# EAGLE design pump-board (EAGLE 7.3.0)
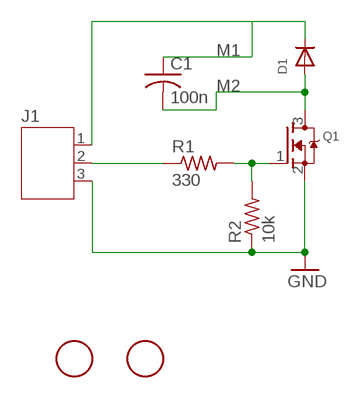
[diagram p0: schematic, sheet 1]

## Parts
C1  100n  C-USC1206  [C1206]
D1  DIODESOD-123  [SOD-123]
J1  JST-PH3  [JST-PH3]
Q1  MOSFET-NREFLOW  [SOT23]
R1  330  R-US_R1206  [R1206]
R2  10k  R-US_R1206  [R1206]
U$1  FIDUCIAL  [FIDUCIAL_1MM]
U$2  FIDUCIAL  [FIDUCIAL_1MM]

## Nets
GATE: Q1.1(G) R1.2 R2.2
GND: J1.3 Q1.2(S) R2.1
M1: C1.1 D1.C J1.1
M2: C1.2 D1.A Q1.3(D)
N$3: J1.2 R1.1

## Library data of the parts
C1 = adafruit:C-US: CAPACITOR, American symbol
D1 = adafruit:DIODE: Diode SMADIODE - SMA Surface Mount Package 20V 1A Schottky Diode Digikey: 641-1014-6-ND DO-1N4148 - Through Hole Small Current Diode SOD-123 20V 1 A (.5mV Vf) Schottky Diode - Digikey: MBRX120TPMSCT-ND SOD-323 10V 570mA (.38mV Vf, 3ns) Schottky Diode - Digikey: ZLLS410CT-ND SOD-523 30V 30mA Schottky Diode (RB751S-40TE61) - Digikey: RB751S-40TE61CT-ND SOT23-R/W - SOT23 Package (R = Solder Paste/Reflow Ovens, W = Hand-Soldering) BAT54Film 40V 300mA - Digikey: 497-7162-1-ND
J1 = jst-ph:JST-PH3
Q1 = adafruit:MOSFET-N: N-Channel Mosfet 2N7002E - 60V 260mA SOT23 [Digikey: 2N7002ET1GOSTR-ND] - REEL BSH103 - 30V 850mA SOT23 [Digikey: 568-5013-1-ND]
R1 R2 = adafruit:R-US_: RESISTOR, American symbol
U$1 U$2 = adafruit:FIDUCIAL: For use by pick and place machines to calibrate the vision/machine, 1mm By microbuilder.eu

## Board
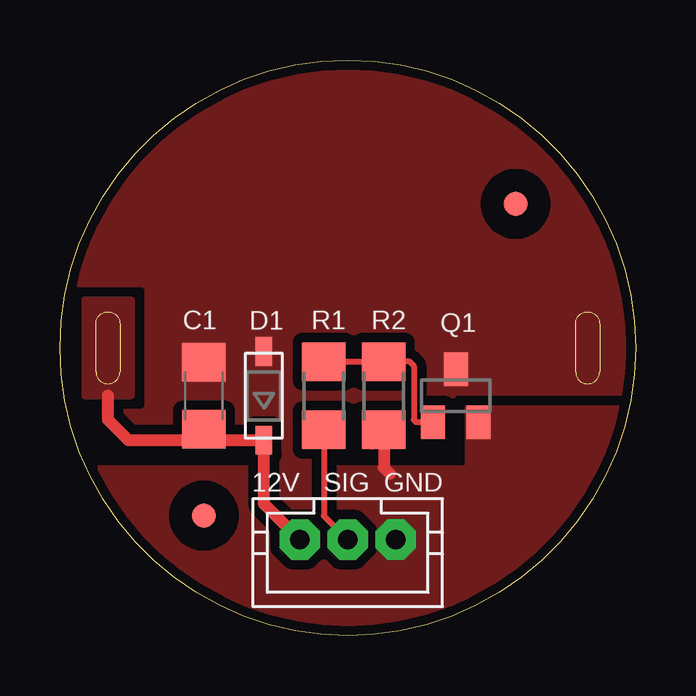
[diagram p1: board, top side]
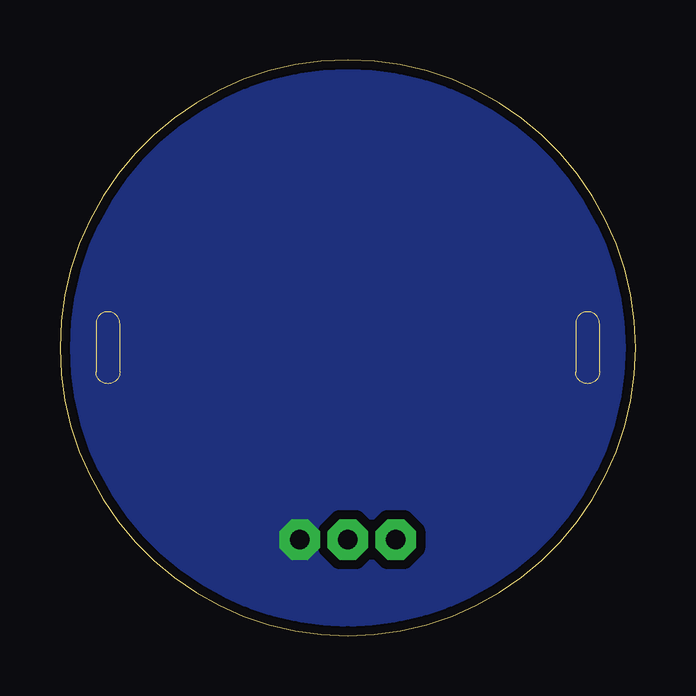
[diagram p2: board, bottom side, seen from below]

Size 24 x 24 mm. Coordinates in mm from the lower left corner, seen from the top.
Outline: 0,12 arc-90 12,24 arc-90 24,12 arc-90 12,0 arc-90 0,12
Copper layers (1*16): Top 0.035mm / dielectric 1.5mm / Bottom 0.035mm
Design rules "default": minimum track width 6mil, minimum drill 0.3mm, track to track 6mil, track to pad 6mil, pad to pad 6mil, via to via 6mil, smd to smd 0mil, copper to edge 0.25mm, drill to drill 0.25mm, minimum pad ring 10mil, minimum via ring 6mil, stop-mask expansion 2mil, vias tented up to drill 100mil, thermal gap 10mil
Milling: 12 lines

### Footprints (pad centres in the part's own frame; a part is rotated, then mirrored left to right if it is on the bottom)
C1206 = smd 1.6 x 1.8: 1 -1.4,0; 2 1.4,0
SOD-123 = smd 1.2 x 0.7: A 1.85,0; C -1.85,0
JST-PH3 = drill 0.813 pad 1.676 octagon: 1 2,0; 2 0,0; 3 -2,0
SOT23 = smd 1 x 1.4: 1 -0.95,-1.1; 2 0.95,-1.1; 3 0,1.1
R1206 = smd 1.6 x 1.803: 1 -1.422,0; 2 1.422,0
FIDUCIAL_1MM = smd 1 x 1: 1 0,0

### Placement (x,y rotation side)
C1  6,10 90 top
D1  8.5,10 90 top
J1  12,4 180 top
Q1  16.5,10 0 top
R1  11,10 90 top
R2  13.5,10 90 top
U$1  6,5 0 top
U$2  19,18 0 top

### Tracks (layer width: path | path; a pad name or v marks a point on that pad's centre or on a via)
GATE
  Top 0.25: R1.2 R2.2 14.58,11.42 14.75,11.25 14.75,9 14.85,8.9 Q1.1
GND
  Top 0.5: 13,8 R2.1 13.5,7 13.75,6.75
  pour Bottom (isolate 0.4, rank 6, no thermals): 0,0 0,24 24,24 24,0
  pour Top (isolate 0.4, rank 5, no thermals): 0,7 17,7 17,9.5 24,9.5 24,0 0,0
M1
  Top 0.5: J1.1 8.5,5.5 D1.C 6,8.15 | 2,10 2,9 2.85,8.15 6,8.15 | 6,8.15 C1.1
  pour Top (isolate 0.25, rank 5, no thermals): 1,14 1,10 3,10 3,14
M2
  pour Top (isolate 0.4, rank 6, no thermals): 0,0 0,24 24,24 24,0
N$3
  Top 0.25: R1.1 11,5 J1.2

### Text on the board
tNames: 12V | SIG | GND